# Altium schematic sheet LM2596.SchDoc
size A4
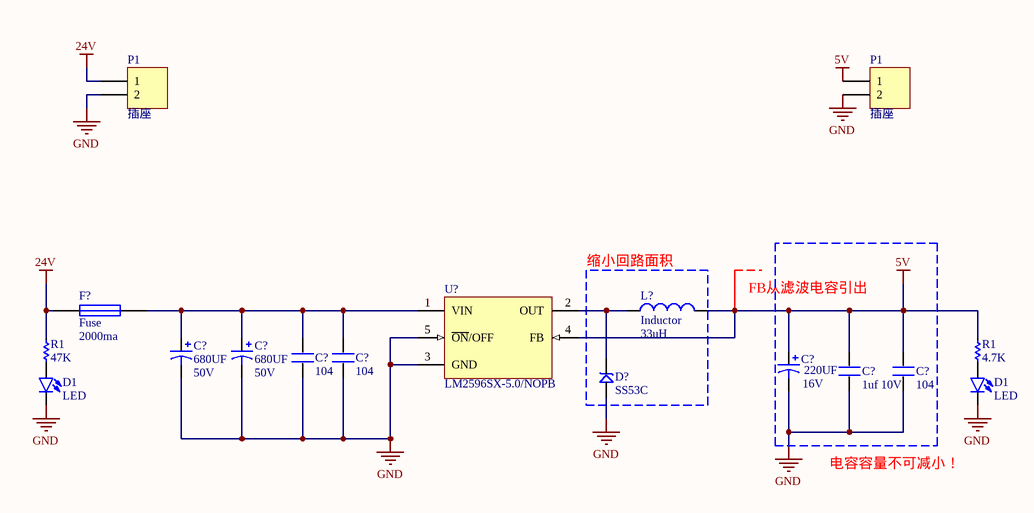
[diagram p0: LM2596.SchDoc]

## Parts
(Parts that share a designator on the sheet are numbered #1, #2 ... from top to bottom, then left to right.)
C?#1  value 680UF  Pressure Voltage: 50V  [CAP 钽 7343 E]  (hidden comment: Cap Poll)
C?#2  value 680UF  Pressure Voltage: 50V  [CAP 钽 7343 E]  (hidden comment: Cap Poll)
C?#3  value 220UF  Pressure Voltage: 16V  [CAP 钽 7343 E]  (hidden comment: Cap Poll)
C?#4  104  [0603P]
C?#5  104  [0603P]
C?#6  1uf 10V  [0603P]
C?#7  104  [0603P]
D1#1  LED  [0603_LED_S1]
D1#2  LED  [0603_LED_S1]
D?  SS53C  [SMBJ]
F?  Fuse  I hold: 2000ma  [1812]
L?  Inductor  value 33uH  [0805_Inductor]
P1#1  插座  [XT30_卧式_公头]
P1#2  插座  [XT30_卧式_公头]
R1#1  47K  [0603_R]
R1#2  4.7K  [0603_R]
U?  LM2596SX-5.0/NOPB  [TO-263-5]

## Blocks framed on the sheet
缩小回路面积: D? L?

## Nets
5V: C?#3.1 C?#6.2 C?#7.2 L?.2 P1#2.1 R1#2.1 U?.4(FB)
24V: F?.1 P1#1.1 R1#1.1
GND: C?#1.2 C?#2.2 C?#3.2 C?#4.1 C?#5.1 C?#6.1 C?#7.1 D1#1.K D1#2.K D?.1 P1#1.2 P1#2.2 U?.3(GND) U?.5(~{ON}/OFF)
NetC?#1_1: C?#1.1 C?#2.1 C?#4.2 C?#5.2 F?.2 U?.1(VIN)
NetD1#1_A: D1#1.A R1#1.2
NetD1#2_A: D1#2.A R1#2.2
NetD?_2: D?.2 L?.1 U?.2(OUT)

## Notes on the sheet
- FB从滤波电容引出
- 电容容量不可减小！

## Library data of the parts
C?#1-C?#3 = Cap Poll: 原理图绘制者: 刘永钦; 原理图何处使用过: 2014年飞思卡尔底板; 原理图审核人1: 徐鹏飞; 封装CAP 钽 7343 E何处使用: 2014年飞思卡尔驱动板; 封装cap贴片铝电解质470uF 16V绘制者: 李泽; 封装cap贴片铝电解质470uF 16V何处使用: 2015年飞思卡尔主板; 封装Cap 3528B绘制者: 陈汉诚; 封装Cap 3528B使用过: 2015年飞思卡尔驱动板; 封装Cap直插 10uF 50V: 10级718学长; 封装Cap直插 10uF 50V使用过: 2012年XS128学习板的主板; 封装Cap 3528B审核人2: 朱觉文; 原理图提供者: 刘永钦; 封装CAP 钽 7343 E绘制者: 刘永钦; 封装CAP 钽 7343 E提供者: 刘永钦; 封装CAP 钽 7343 E审核人1: 徐鹏飞; 封装cap贴片铝电解质470uF 16V提供者: 刘永钦; 封装cap贴片铝电解质470uF 16V审核人1: 徐鹏飞; 封装Cap 3528B提供者: 刘永钦; 封装Cap 3528B审核人1: 徐鹏飞; 封装Cap直插 10uF 50V提供者: 刘永钦; 封装Cap直插 10uF 50V审核人1: 徐鹏飞; 封装Cap直插 10uF 50V审核人2: 朱觉文; 封装cap贴片铝电解质470uF 16V审核人2: 朱觉文; 封装CAP 钽 7343 E审核人2: 朱觉文; 原理图审核人2: 朱觉文
C?#4-C?#7 = C_1
D1#1 D1#2 = LED: 发光二极管; ComponentLink1Description: 供应商链接; ComponentLink1URL: http://www.szlcsc.com/product/details_2663.html; Package: 0603; Supplier: LC; SuppliersPartNumber: C2290
D? = SMBJ: TVS
F? = Fuse: 封装1812审核人2: 朱觉文; 封装1812审核人1: 徐鹏飞; 封装1812提供者: 刘永钦; 封装1812何处使用过: 2401转接板; 封装1812绘制者: 刘永钦; 原理图审核人2: 朱觉文; 原理图审核人1: 徐鹏飞; 原理图何处使用过: 2401转接板; 原理图提供者: 刘永钦; 原理图绘制者: 刘永钦
L? = Inductor: 原理图绘制者: 刘永钦; 原理图何处使用过: 2014年飞思卡尔底板; 原理图审核人1: 徐鹏飞; 封装0805_Inductor绘制者: 未知; 封装0805_Inductor使用过: 2015年飞思卡尔底板; 原理图审核人2: 朱觉文; 原理图提供者: 刘永钦; 封装0805_Inductor提供者: 刘永钦; 封装0805_Inductor审核人1: 徐鹏飞; 封装0805_Inductor审核人2: 朱觉文
P1#1 P1#2 = Header 2: Header, 2-Pin; LatestRevisionDate: 17-Jul-2002; LatestRevisionNote: Re-released for DXP Platform.; Publisher: Altium Limited
R1#1 R1#2 = Res3
U? = LM2596SX-5.0/NOPB_[C10002]: DC-DC芯片; ComponentLink1Description: 供应商链接; ComponentLink1URL: http://www.szlcsc.com/product/details_10538.html; Package: TO-263-5; Supplier: LC; SuppliersPartNumber: C10002